# Altium schematic sheet 前端.SchDoc
size A3
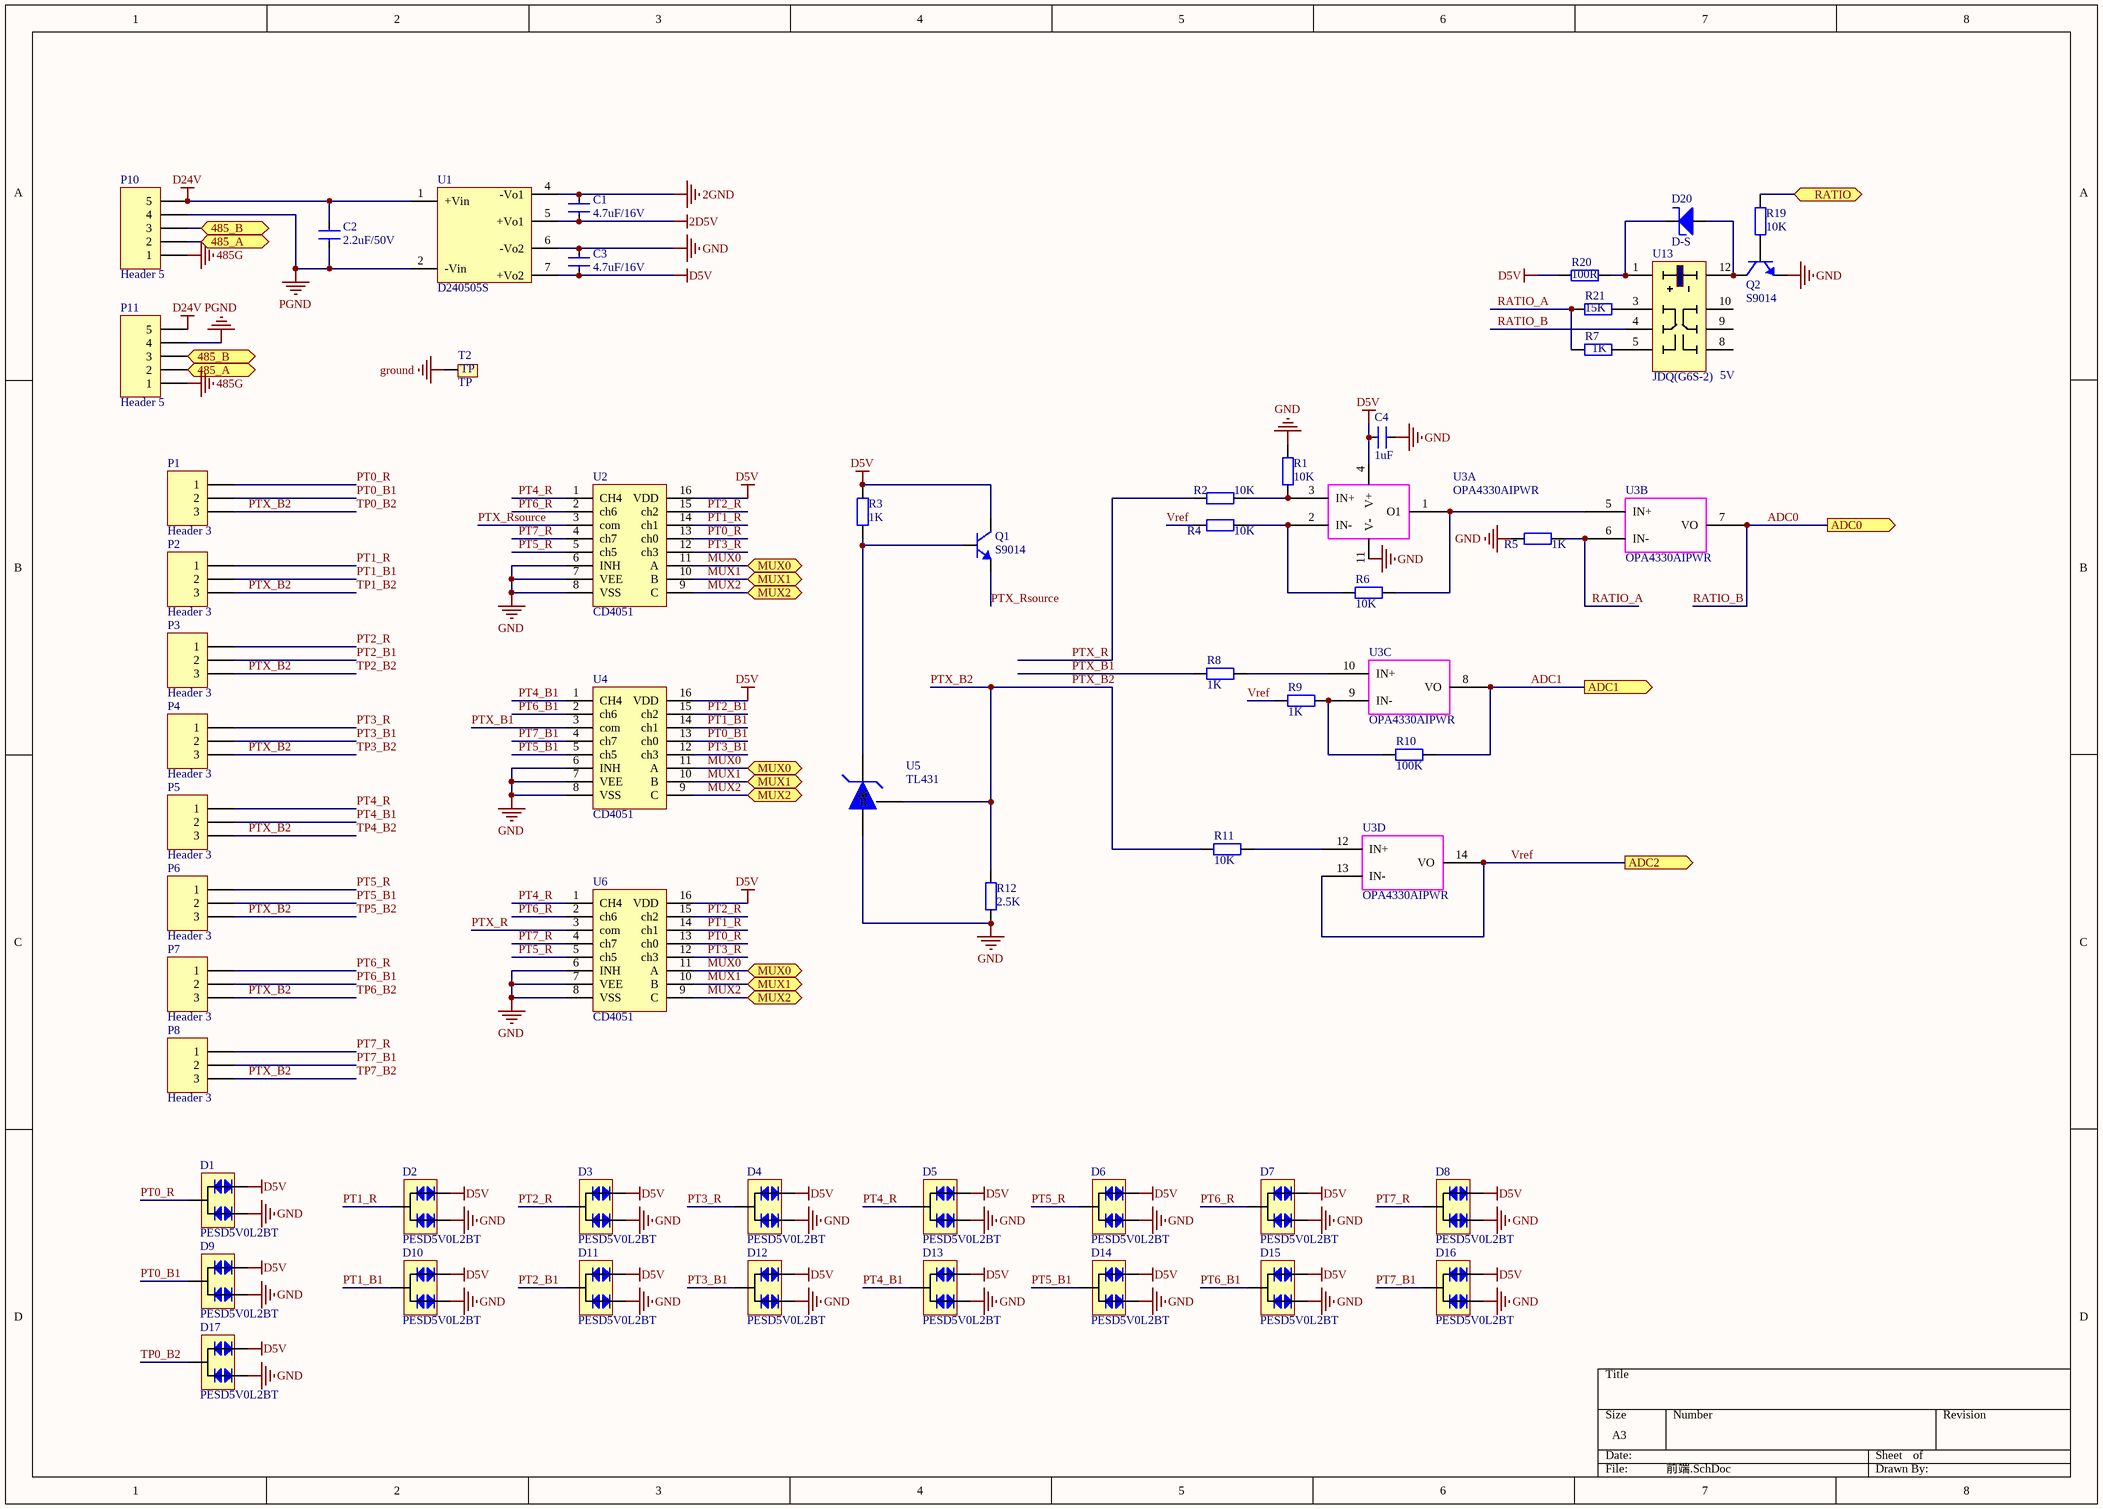
[diagram p0: 前端.SchDoc]

## Parts
C1  4.7uF/16V  [0805C]
C2  2.2uF/50V  [0805C]
C3  4.7uF/16V  [0805C]
C4  1uF  [0603C]
D1  PESD5V0L2BT  [SOT23A]
D2  PESD5V0L2BT  [SOT23A]
D3  PESD5V0L2BT  [SOT23A]
D4  PESD5V0L2BT  [SOT23A]
D5  PESD5V0L2BT  [SOT23A]
D6  PESD5V0L2BT  [SOT23A]
D7  PESD5V0L2BT  [SOT23A]
D8  PESD5V0L2BT  [SOT23A]
D9  PESD5V0L2BT  [SOT23A]
D10  PESD5V0L2BT  [SOT23A]
D11  PESD5V0L2BT  [SOT23A]
D12  PESD5V0L2BT  [SOT23A]
D13  PESD5V0L2BT  [SOT23A]
D14  PESD5V0L2BT  [SOT23A]
D15  PESD5V0L2BT  [SOT23A]
D16  PESD5V0L2BT  [SOT23A]
D17  PESD5V0L2BT  [SOT23A]
D20  D-S  [SOD123]
P1  Header 3  [KF2DEG-3.81-3]
P2  Header 3  [KF2DEG-3.81-3]
P3  Header 3  [KF2DEG-3.81-3]
P4  Header 3  [KF2DEG-3.81-3]
P5  Header 3  [KF2DEG-3.81-3]
P6  Header 3  [KF2DEG-3.81-3]
P7  Header 3  [KF2DEG-3.81-3]
P8  Header 3  [KF2DEG-3.81-3]
P10  Header 5  [KF2DEG-3.81-5]
P11  Header 5  [KF2DEG-3.81-5]
Q1  S9014  [SOT23A]
Q2  S9014  [SOT23A]
R1  10K  [0603R]
R2  10K  [0603R]
R3  1K  [0603R]
R4  10K  [0603R]
R5  1K  [0603R]
R6  10K  [0603R]
R7  1K  [0603R]
R8  1K  [0603R]
R9  1K  [0603R]
R10  100K  [0603R]
R11  10K  [0603R]
R12  2.5K  [0603R]
R19  10K  [0603R]
R20  100R  [0603R]
R21  15K  [0603R]
T2  TP  [TP1]
U1  D240505S  [D240505S-2W]
U2  CD4051  [SOP16]
U3  OPA4330AIPWR  [TSSOP14-65]  (parts A,B,C,D of 4)
U4  CD4051  [SOP16]
U5  TL431  [SOT-89]
U6  CD4051  [SOP16]
U13  JDQ(G6S-2)  [JDQ-G6S-2]

## Ports
485_A, 485_B, ADC0 (out), ADC1 (out), ADC2 (out), MUX0, MUX1, MUX2, RATIO

## Nets
2D5V: C1.2 U1.5(+Vo1)
2GND: C1.1 U1.4(-Vo1)
485G: P10.1 P11.1
D5V: C3.2 C4.2 D1.2 D2.2 D3.2 D4.2 D5.2 D6.2 D7.2 D8.2 D9.2 D10.2 D11.2 D12.2 D13.2 D14.2 D15.2 D16.2 D17.2 Q1.C R3.2 R20.2 U1.7(+Vo2) U2.16(VDD) U3.4(V+) U4.16(VDD) U6.16(VDD)
D24V: C2.1 P10.5 P11.5 U1.1(+Vin)
GND: C3.1 C4.1 D1.1 D2.1 D3.1 D4.1 D5.1 D6.1 D7.1 D8.1 D9.1 D10.1 D11.1 D12.1 D13.1 D14.1 D15.1 D16.1 D17.1 Q2.E R1.1 R5.2 R12.1 U1.6(-Vo2) U2.6(INH) U2.7(VEE) U2.8(VSS) U3.11(V-) U4.6(INH) U4.7(VEE) U4.8(VSS) U5.2(A) U6.6(INH) U6.7(VEE) U6.8(VSS)
ground: T2.1
PGND: C2.2 P10.4 P11.4 U1.2(-Vin)
485_A: P10.2 P11.2 ; port 485_A
485_B: P10.3 P11.3 ; port 485_B
ADC0: U3.7(VO) U13.4 ; port ADC0  [also labelled RATIO_B]
ADC1: R10.1 U3.8(VO) ; port ADC1
MUX0: U2.11(A) U4.11(A) U6.11(A) ; port MUX0
MUX1: U2.10(B) U4.10(B) U6.10(B) ; port MUX1
MUX2: U2.9(C) U4.9(C) U6.9(C) ; port MUX2
PT0_B1: D9.3 P1.2 U4.13(ch0)
PT0_R: D1.3 P1.1 U2.13(ch0) U6.13(ch0)
PT1_B1: D10.3 P2.2 U4.14(ch1)
PT1_R: D2.3 P2.1 U2.14(ch1) U6.14(ch1)
PT2_B1: D11.3 P3.2 U4.15(ch2)
PT2_R: D3.3 P3.1 U2.15(ch2) U6.15(ch2)
PT3_B1: D12.3 P4.2 U4.12(ch3)
PT3_R: D4.3 P4.1 U2.12(ch3) U6.12(ch3)
PT4_B1: D13.3 P5.2 U4.1(CH4)
PT4_R: D5.3 P5.1 U2.1(CH4) U6.1(CH4)
PT5_B1: D14.3 P6.2 U4.5(ch5)
PT5_R: D6.3 P6.1 U2.5(ch5) U6.5(ch5)
PT6_B1: D15.3 P7.2 U4.2(ch6)
PT6_R: D7.3 P7.1 U2.2(ch6) U6.2(ch6)
PT7_B1: D16.3 P8.2 U4.4(ch7)
PT7_R: D8.3 P8.1 U2.4(ch7) U6.4(ch7)
PTX_B1: R8.2 U4.3(com)
PTX_B2: D17.3 P1.3 P2.3 P3.3 P4.3 P5.3 P6.3 P7.3 P8.3 R11.2 R12.2 U5.1(R)  [also labelled TP0_B2, TP1_B2, TP2_B2, TP3_B2, TP4_B2, TP5_B2, TP6_B2, TP7_B2]
PTX_R: R2.2 U6.3(com)
PTX_Rsource: Q1.E U2.3(com)
RATIO: R19.1 ; port RATIO
RATIO_A: R5.1 R7.1 R21.1 U3.6(IN-)
Vref: R4.2 R9.2 U3.13(IN-) U3.14(VO) ; port ADC2
NetD20_A: D20.A Q2.C U13.12
NetD20_K: D20.K R20.1 U13.1
NetQ1_B: Q1.B R3.1 U5.3(K)
NetQ2_B: Q2.B R19.2
NetR1_2: R1.2 R2.1 U3.3(IN+)
NetR4_1: R4.1 R6.2 U3.2(IN-)
NetR6_1: R6.1 U3.1(O1) U3.5(IN+)
NetR7_2: R7.2 U13.5
NetR8_1: R8.1 U3.10(IN+)
NetR9_1: R9.1 R10.2 U3.9(IN-)
NetR11_1: R11.1 U3.12(IN+)
NetR21_2: R21.2 U13.3

Not connected (* = marked no-connect by the designer): U13 8 9 10

## Notes on the sheet
- (near U13) 5V

## Library data of the parts
C1-C4 = CAP: 普通小电容; 电压: 50V
D1-D17 = PESD5V0L2BT: schottky diod
D20 = D-S: 肖特基二极管
P1-P8 = Header 3: Header, 3-Pin; LatestRevisionDate: 17-Jul-2002; LatestRevisionNote: Re-released for DXP Platform.; Publisher: Altium Limited
P10 P11 = Header 5: Header, 5-Pin; LatestRevisionDate: 17-Jul-2002; LatestRevisionNote: Re-released for DXP Platform.; Publisher: Altium Limited
Q1 Q2 = NPN: NPN三极管; pin to pad: B>1 C>3 E>2; Published: 8-Jun-2000; LatestRevisionDate: 15-Jan-2003; LatestRevisionNote: PCB Footprint 'BCY-W3/D4.7' replaced; DatasheetDocument: 1997; PackageDocument: Sep-1998; PackageReference: TO-92A; Publisher: Altium Limited; Code_JEDEC: TO-92A; ComponentLink1Description: Manufacturer Link; ComponentLink1URL: http://www.fairchildsemi.com/; ComponentLink2Description: Datasheet; ComponentLink2URL: http://www.fairchildsemi.com/ds/2N%2F2N3904.pdf
R1-R12 R19-R21 = RES: 普通电阻
T2 = TP: testpoint
U1 = D240505S-2W: 24V转双5V隔离DCDC
U2 U4 U6 = CD4051: 模拟多路复用器
U3 = OPA4330: 输出轨到轨，4运放
U13 = JDQ(G6S-2): 继电器（G6S-2 5VDC）